# EAGLE schematic Gecko-Node (EAGLE 9.6.2)
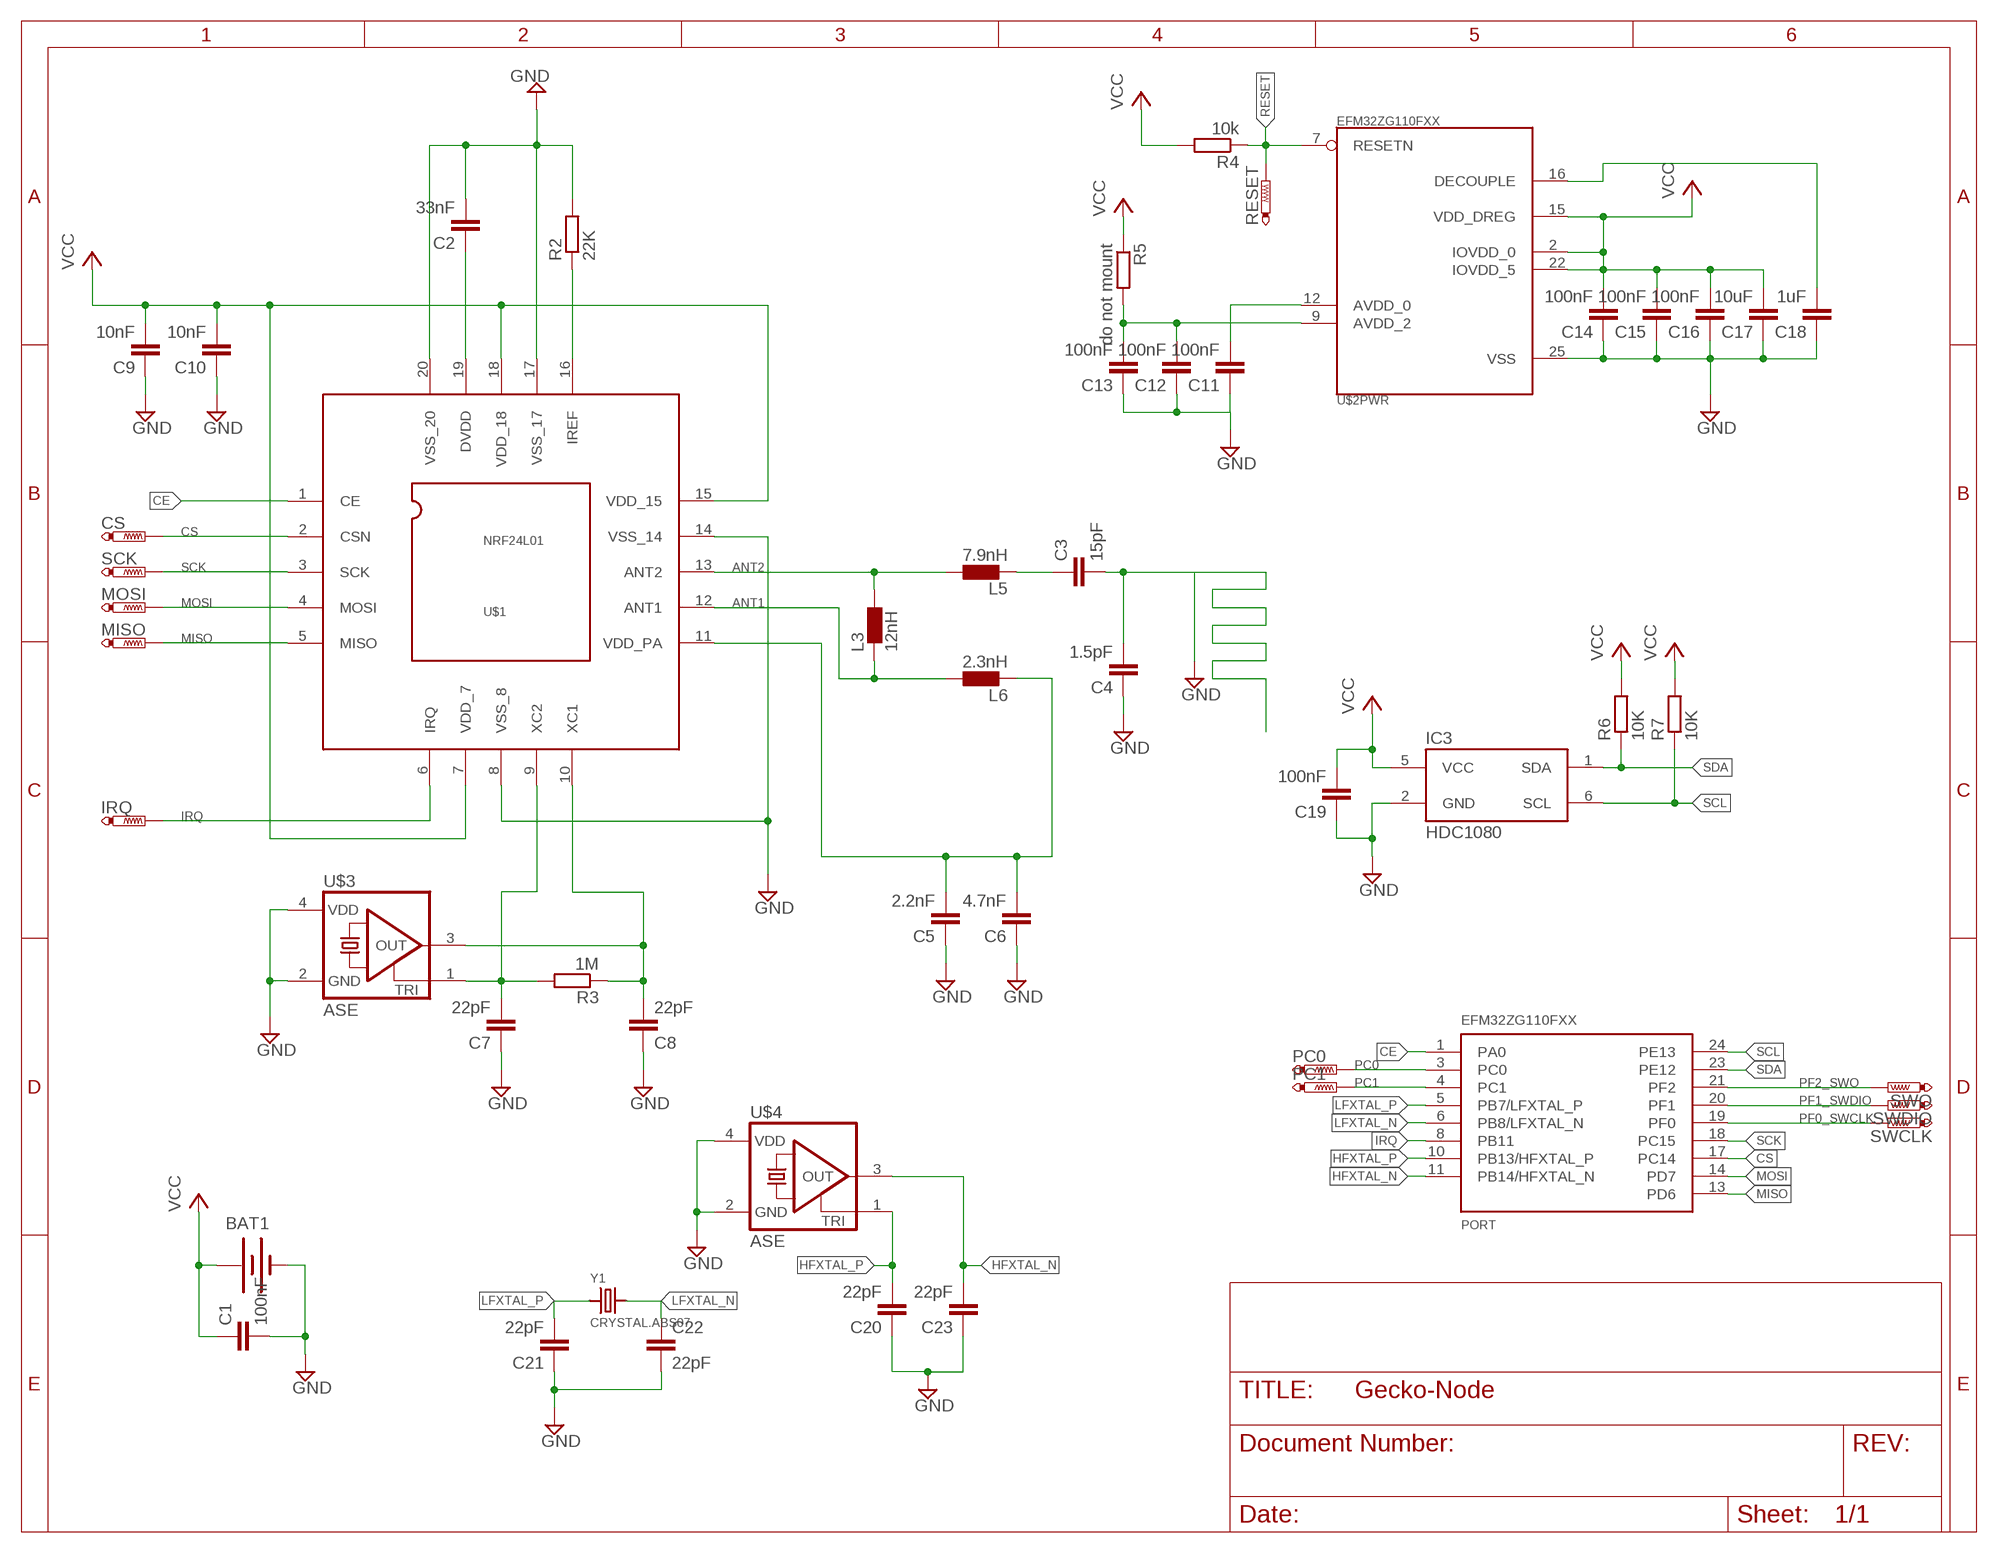
[diagram p0: schematic, sheet 1]

## Parts
BAT1  LINX-BAT-HLD-00120SMD  [BATTCON_20MM]
C1  100nF  C-EUC0603  [C0603]
C2  33nF  C-EUC0603  [C0603]
C3  15pF  C-EUC0603  [C0603]
C4  1.5pF  C-EUC0603  [C0603]
C5  2.2nF  C-EUC0603  [C0603]
C6  4.7nF  C-EUC0603  [C0603]
C7  22pF  C-EUC0603  [C0603]
C8  22pF  C-EUC0603  [C0603]
C9  10nF  C-EUC0603  [C0603]
C10  10nF  C-EUC0603  [C0603]
C11  100nF  C-EUC0603  [C0603]
C12  100nF  C-EUC0603  [C0603]
C13  100nF  C-EUC0603  [C0603]
C14  100nF  C-EUC0603  [C0603]
C15  100nF  C-EUC0603  [C0603]
C16  100nF  C-EUC0603  [C0603]
C17  10uF  C-EUC0603  [C0603]
C18  1uF  C-EUC0603  [C0603]
C19  100nF  C-EUC0603  [C0603]
C20  22pF  C-EUC0603  [C0603]
C21  22pF  C-EUC0603  [C0603]
C22  22pF  C-EUC0603  [C0603]
C23  22pF  C-EUC0603  [C0603]
CS  PTR1TP08R  [TP08R]
IC3  HDC1080  [WSON6]
IRQ  PTR1TP08R  [TP08R]
L3  12nH  L  [R0603]
L5  7.9nH  L  [R0603]
L6  2.3nH  L  [R0603]
MISO  PTR1TP08R  [TP08R]
MOSI  PTR1TP08R  [TP08R]
PC0  PTR1TP08R  [TP08R]
PC1  PTR1TP08R  [TP08R]
R2  22K  R-EU_R0603  [R0603]
R3  1M  R-EU_R0603  [R0603]
R4  10k  R-EU_R0603  [R0603]
R5  do not mount  R-EU_R0603  [R0603]
R6  10K  R-EU_R0603  [R0603]
R7  10K  R-EU_R0603  [R0603]
RESET  PTR1TP08R  [TP08R]
SCK  PTR1TP08R  [TP08R]
SWCLK  PTR1TP08R  [TP08R]
SWDIO  PTR1TP08R  [TP08R]
SWO  PTR1TP08R  [TP08R]
U$1  NRF24L01  [QFN20]
U$2  EFM32ZG110FXX  [QFN24]
U$3  ASE  [ASE]
U$4  ASE  [ASE]
Y1  CRYSTAL.ABS07  [ABS07]

## Nets
ANT1: L3.2 L6.1 U$1.12(ANT1)
ANT2: L3.1 L5.1 U$1.13(ANT2)
CE: U$1.1(CE) U$2.1(A:PA0)
CS: CS.TP U$1.2(CSN) U$2.17(A:PC14)
DECOUPLE: C18.2 U$2.16(PWR:DECOUPLE)
GND: BAT1.2(-) C1.2 C2.2 C3.2 C4.1 C4.2 C5.1 C6.1 C7.1 C8.1 C9.1 C10.1 C11.1 C12.1 C13.1 C14.1 C15.1 C16.1 C17.1 C18.1 C19.1 C20.1 C21.1 C22.2 C23.1 IC3.2(GND) R2.2 U$1.8(VSS_8) U$1.14(VSS_14) U$1.17(VSS_17) U$1.20(VSS_20) U$2.25(PWR:VSS) U$3.2(GND) U$3.4(VDD) U$4.2(GND) U$4.4(VDD)
HFXTAL_N: C23.2 U$2.11(A:PB14/HFXTAL_N) U$4.3(OUT)
HFXTAL_P: C20.2 U$2.10(A:PB13/HFXTAL_P) U$4.1(TRI)
IRQ: IRQ.TP U$1.6(IRQ) U$2.8(A:PB11)
LFXTAL_N: C22.1 U$2.6(A:PB8/LFXTAL_N) Y1.2
LFXTAL_P: C21.2 U$2.5(A:PB7/LFXTAL_P) Y1.1
MISO: MISO.TP U$1.5(MISO) U$2.13(A:PD6)
MOSI: MOSI.TP U$1.4(MOSI) U$2.14(A:PD7)
N$2: C7.2 R3.2 U$1.9(XC2) U$3.1(TRI)
N$3: R2.1 U$1.16(IREF)
N$4: C2.1 U$1.19(DVDD)
N$5: C8.2 R3.1 U$1.10(XC1) U$3.3(OUT)
N$8: C3.1 L5.2
N$10: C11.2 U$2.12(PWR:AVDD_0)
N$11: C5.2 C6.2 L6.2 U$1.11(VDD_PA)
N$12: C12.2 C13.2 R5.2 U$2.9(PWR:AVDD_2)
PC0: PC0.TP U$2.3(A:PC0)
PC1: PC1.TP U$2.4(A:PC1)
PF0_SWCLK: SWCLK.TP U$2.19(A:PF0)
PF1_SWDIO: SWDIO.TP U$2.20(A:PF1)
PF2_SWO: SWO.TP U$2.21(A:PF2)
RESET: R4.1 RESET.TP U$2.7(PWR:RESETN)
SCK: SCK.TP U$1.3(SCK) U$2.18(A:PC15)
SCL: IC3.6(SCL) R7.1 U$2.24(A:PE13)
SDA: IC3.1(SDA) R6.1 U$2.23(A:PE12)
VCC: BAT1.1(+) BAT1.3(+) C1.1 C9.2 C10.2 C14.2 C15.2 C16.2 C17.2 C19.2 IC3.5(VCC) R4.2 R5.1 R6.2 R7.2 U$1.7(VDD_7) U$1.15(VDD_15) U$1.18(VDD_18) U$2.2(PWR:IOVDD_0) U$2.15(PWR:VDD_DREG) U$2.22(PWR:IOVDD_5)

## Library data of the parts
BAT1 = battery:LINX-BAT-HLD-001: Battery Holders Linxtechnologies CR2032 battery holder: http://www.linxtechnologies.com/resources/diagrams/bat-hld-001.pdf
C1-C23 = rcl:C-EU: CAPACITOR, European symbol
CS IRQ MISO MOSI PC0 PC1 RESET SCK SWCLK SWDIO SWO = testpad:PTR1: TEST PIN
IC3 = HDC1080:HDC1080
L3 L5 L6 = L0603:L: INDUCTOR, European symbol
R2-R7 = rcl:R-EU_: RESISTOR, European symbol
U$1 = nrf24l01:NRF24L01: nRF24L01 Single chip 2.4GHz transceiver from Nordic Semiconductors.
U$2 = ZeroGecko:EFM32ZG110FXX: EFM32ZG110FXX Zero Microcontroller in 5mm x 5mm QFN24 package
U$3 U$4 = crystal:ASE: 3.3Vdc CMOS SMD CRYSTAL CLOCK OSCILLATOR SOurce: www.abracon.com; OC_FARNELL: unknown; OC_NEWARK: unknown
Y1 = abracon:CRYSTAL